# EasyEDA schematic Heartmonitor_schem_EasyEDA.json
TITLE: Heart sensor to ESP32 schem; REV: 2.0; Date: 2021-04-01; Sheet: 1/1; Drawn By: Neivydas Misiukonis; Company: Vensim
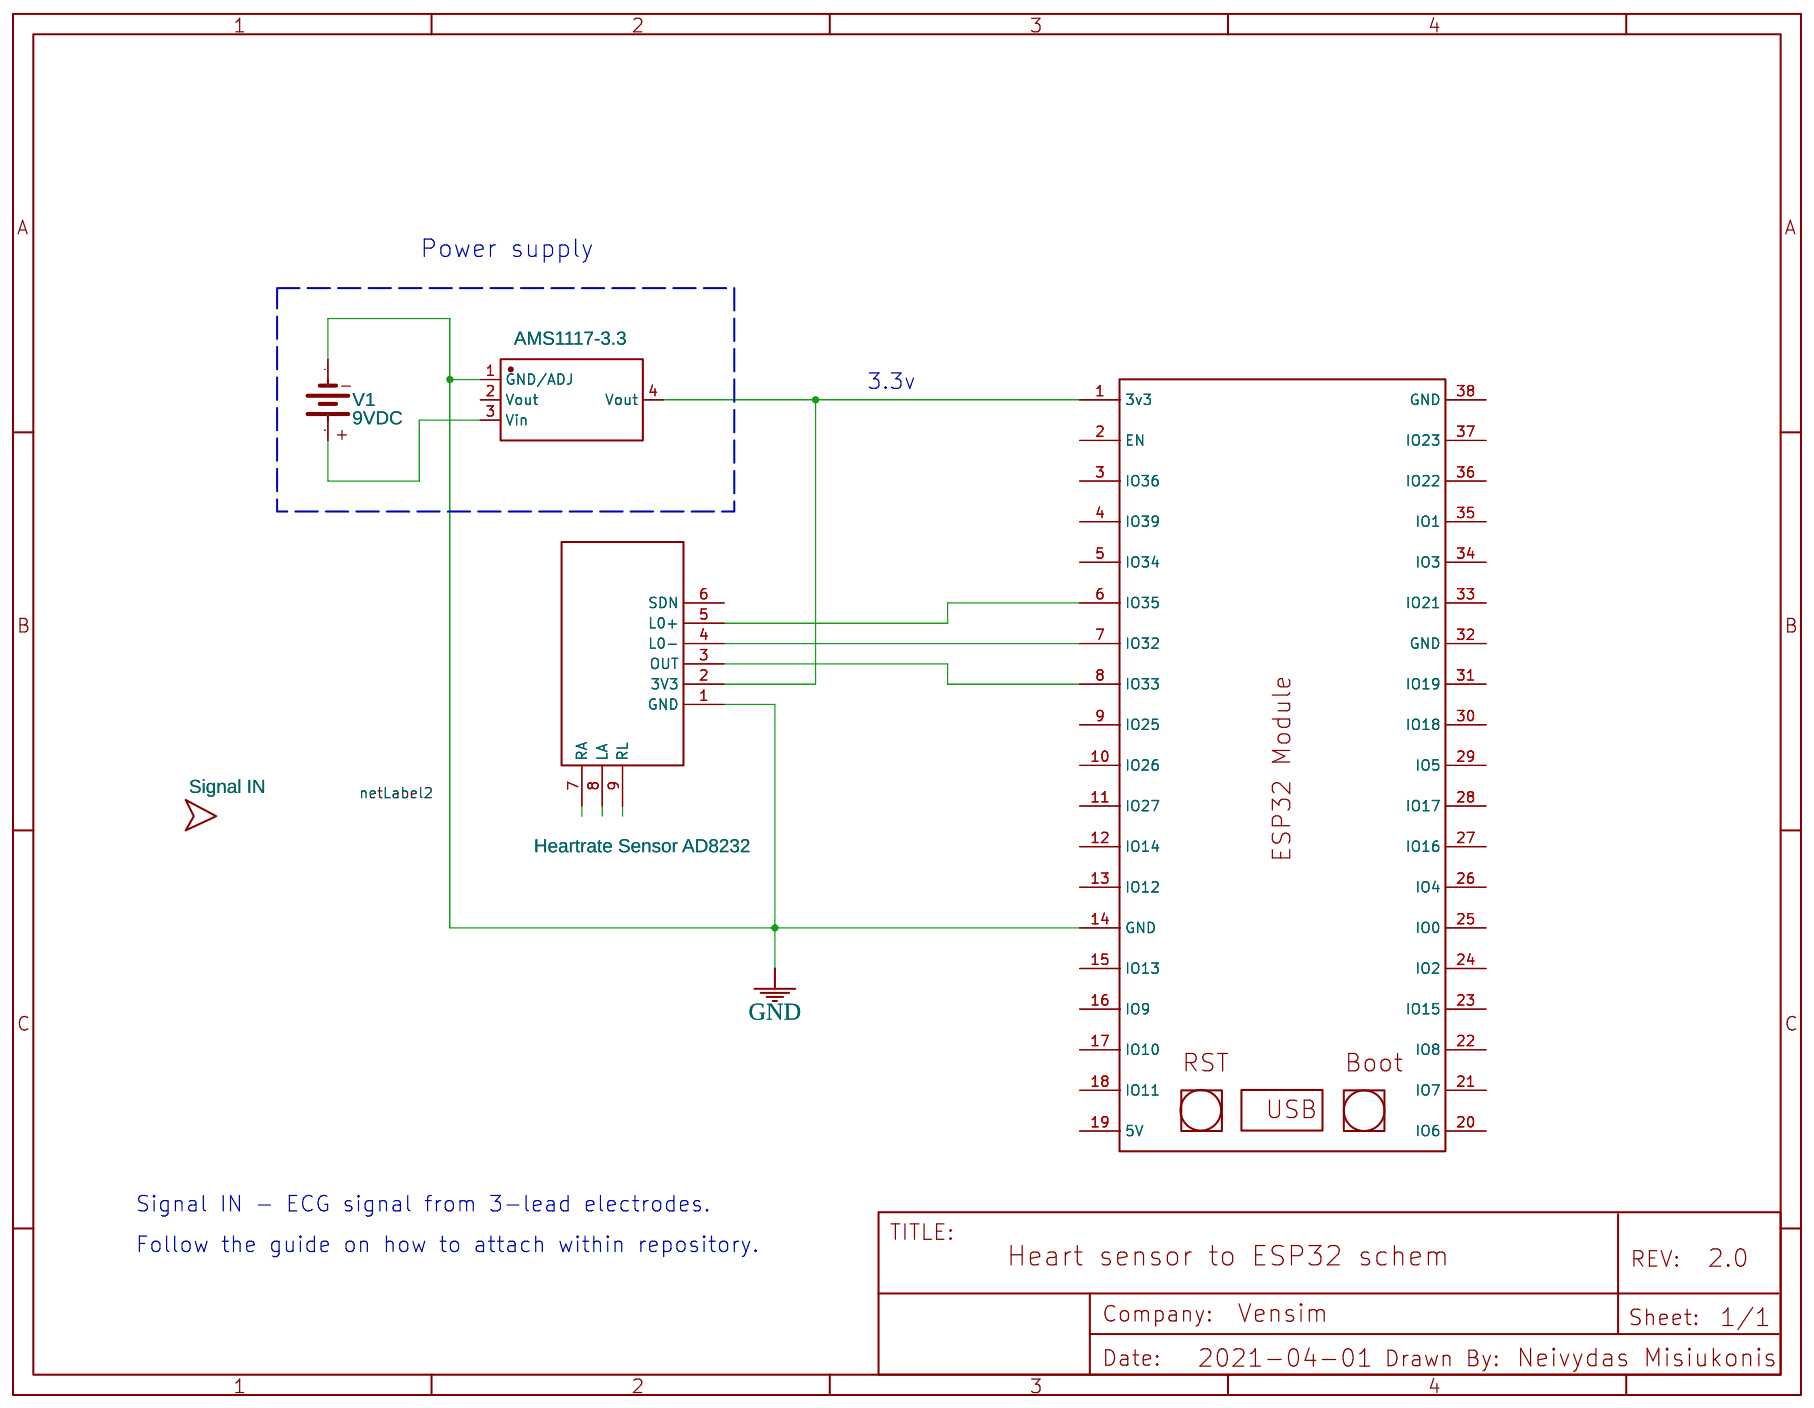
[diagram p0: schematic sheet]

## Parts
U1  Heartrate Sensor AD8232  [HEARTRATE SENSOR AD8232]
U2  ESP32 BLADE  [AZ-DELIVERY NODEMCU ESP32 DEV KIT]
U3  AMS1117-3.3  [SOT-223-3_L6.5-W3.4-P2.30-LS7.0-BR]
U4  Signal IN
V1  9VDC  [AB9V]

## Library data of the parts
U1 = Heartrate Sensor AD8232: Contributor: allvex
U2 = ESP32 BLADE: Manufacturer Part: ESP32; Contributor: Bardssss; link: https://www.espressif.com/en/products/hardware/esp32-devkitc/overview
U3 = AMS1117-3.3: sourceId: dwIGgezVh; Supplier: LCSC; Manufacturer: AMS; image: //image.lceda.cn/szlcsc/C6186.jpg; Supplier Part: C6186; SMT Type: Basic; JLCPCB SMD: Yes; LCSC Assembly: Yes; Paste Type: base
U4 = Signal IN: Contributor: HICOCO
V1 = DC

## Nets
GND: U1.1(GND) U2.14(GND) U3.1(GND/ADJ) V1.-
Net-(U1-2): U1.2(3V3) U2.1(3v3) U3.4(Vout)
Net-(U1-3): U1.3(OUT) U2.8(IO33)
Net-(U1-4): U1.4(L0-) U2.7(IO32)
Net-(U1-5): U1.5(L0+) U2.6(IO35)
Net-(U3-3): U3.3(Vin) V1.+

Not connected (* = marked no-connect by the designer): U1 6(SDN) 7(RA) 8(LA) 9(RL); U2 2(EN) 3(IO36) 4(IO39) 5(IO34) 9(IO25) 10(IO26) 11(IO27) 12(IO14) 13(IO12) 15(IO13) 16(IO9) 17(IO10) 18(IO11) 19(5V) 20(IO6) 21(IO7) 22(IO8) 23(IO15) 24(IO2) 25(IO0) 26(IO4) 27(IO16) 28(IO17) 29(IO5) 30(IO18) 31(IO19) 32(GND) 33(IO21) 34(IO3) 35(IO1) 36(IO22) 37(IO23) 38(GND); U3 2(Vout)

## Notes on the sheet
- Power supply
- 3.3v
- Signal IN - ECG signal from 3-lead electrodes.
- Follow the guide on how to attach within repository.
